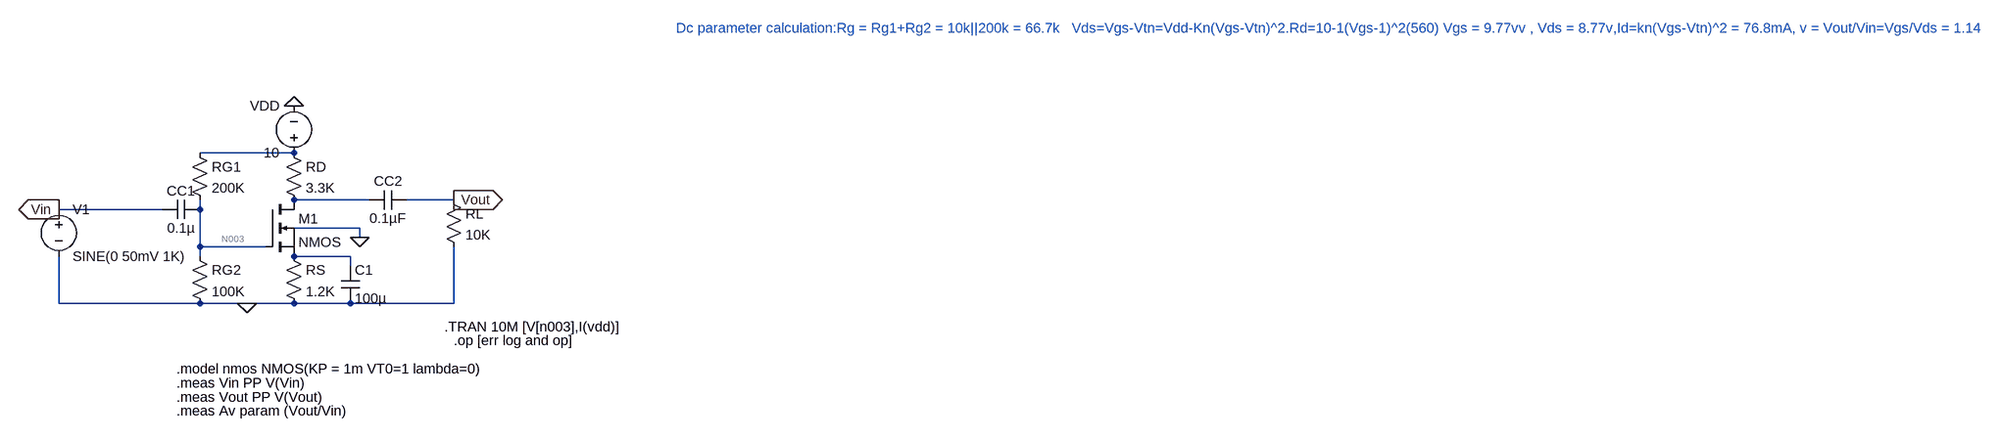
[diagram p0: schematic CS_AMP.asc]
CS_AMP.asc, the LTspice schematic file:
Version 4
SHEET 1 4456 680
WIRE 256 32 96 32
WIRE 384 112 256 112
WIRE 528 112 448 112
WIRE 32 128 -144 128
WIRE 96 128 96 112
WIRE 368 160 256 160
WIRE 368 176 368 160
WIRE 96 192 96 128
WIRE 208 192 96 192
WIRE 96 208 96 192
WIRE 352 208 256 208
WIRE 352 224 352 208
WIRE -144 288 -144 208
WIRE 96 288 -144 288
WIRE 176 288 96 288
WIRE 256 288 176 288
WIRE 352 288 256 288
WIRE 528 288 528 192
WIRE 528 288 352 288
FLAG 368 176 0
FLAG 176 288 0
FLAG 256 -48 0
FLAG -144 128 Vin
IOPIN -144 128 Out
FLAG 528 112 Vout
IOPIN 528 112 Out
SYMBOL res 80 192 R0
SYMATTR InstName RG2
SYMATTR Value 100K
SYMBOL res 80 16 R0
SYMATTR InstName RG1
SYMATTR Value 200K
SYMBOL res 240 16 R0
SYMATTR InstName RD
SYMATTR Value 3.3K
SYMBOL res 240 192 R0
SYMATTR InstName RS
SYMATTR Value 1.2K
SYMBOL res 512 96 R0
SYMATTR InstName RL
SYMATTR Value 10K
SYMBOL nmos 208 112 R0
SYMATTR InstName M1
SYMBOL voltage -144 112 R0
SYMATTR InstName V1
SYMATTR Value SINE(0 50mV 1K)
SYMBOL cap 448 96 R90
WINDOW 0 0 32 VBottom 2
WINDOW 3 32 32 VTop 2
SYMATTR InstName CC2
SYMATTR Value 0.1µF
SYMBOL voltage 256 48 R180
WINDOW 0 24 96 Left 2
WINDOW 3 24 16 Left 2
SYMATTR InstName VDD
SYMATTR Value 10
SYMBOL cap 96 112 R90
WINDOW 0 0 32 VBottom 2
WINDOW 3 32 32 VTop 2
SYMATTR InstName CC1
SYMATTR Value 0.1µ
SYMBOL cap 336 224 R0
SYMATTR InstName C1
SYMATTR Value 100µ
TEXT 56 400 Left 2 !.model nmos NMOS(KP = 1m VT0=1 lambda=0)
TEXT 56 424 Left 2 !.meas Vin PP V(Vin)
TEXT 56 448 Left 2 !.meas Vout PP V(Vout)
TEXT 56 472 Left 2 !.meas Av param (Vout/Vin)
TEXT 512 328 Left 2 !.TRAN 10M [V[n003],I(vdd)]
TEXT 528 352 Left 2 !.op [err log and op]
TEXT 1976 -1392 Left 2 ;Dc parameter calculation:Rg = Rg1+Rg2 = 10k||200k = 66.7k   Vds=Vgs-Vtn=Vdd-Kn(Vgs-Vtn)^2.Rd=10-1(Vgs-1)^2(560) Vgs = 9.77vv , Vds = 8.77v,Id=kn(Vgs-Vtn)^2 = 76.8mA, v = Vout/Vin=Vgs/Vds = 1.14

The netlist it stands for:
* CS_AMP.asc
RG2 N003 0 100K
RG1 N001 N003 200K
RD N001 N002 3.3K
RS N004 0 1.2K
RL Vout 0 10K
M1 N002 N003 N004 N004 NMOS
V1 Vin 0 SINE(0 50mV 1K)
CC2 Vout N002 0.1µF
VDD N001 0 10
CC1 N003 Vin 0.1µ
C1 N004 0 100µ
.model NMOS NMOS
.model PMOS PMOS
.lib standard.mos
.model nmos NMOS(KP = 1m VT0=1 lambda=0)
.meas Vin PP V(Vin)
.meas Vout PP V(Vout)
.meas Av param (Vout/Vin)
.TRAN 10M [V[n003],I(vdd)]
.op [err log and op]
* Dc parameter calculation:Rg = Rg1+Rg2 = 10k||200k = 66.7k   Vds=Vgs-Vtn=Vdd-Kn(Vgs-Vtn)^2.Rd=10-1(Vgs-1)^2(560) Vgs = 9.77vv , Vds = 8.77v,Id=kn(Vgs-Vtn)^2 = 76.8mA, v = Vout/Vin=Vgs/Vds = 1.14
.backanno
.end